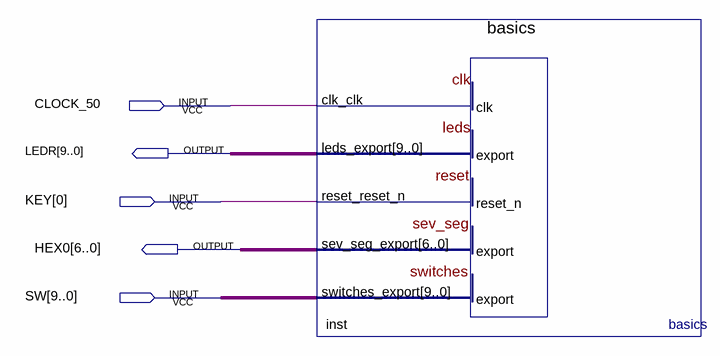
[diagram p0: schematic sheet]
// Quartus schematic accelerator.bdf as structural Verilog: 1 symbols, 5 pins
module accelerator (
  input  CLOCK_50,
  input  [0:0] KEY,
  input  [9:0] SW,
  output [9:0] LEDR,
  output [6:0] HEX0
);

  basics inst (
    .clk_clk(CLOCK_50), .reset_reset_n(KEY[0]), .switches_export(SW), .leds_export(LEDR),
    .sev_seg_export(HEX0));
endmodule
